# Altium schematic sheet PCB_Project_MCU.SchDoc
size A4; SheetTotal: 6; ImagePath: 6
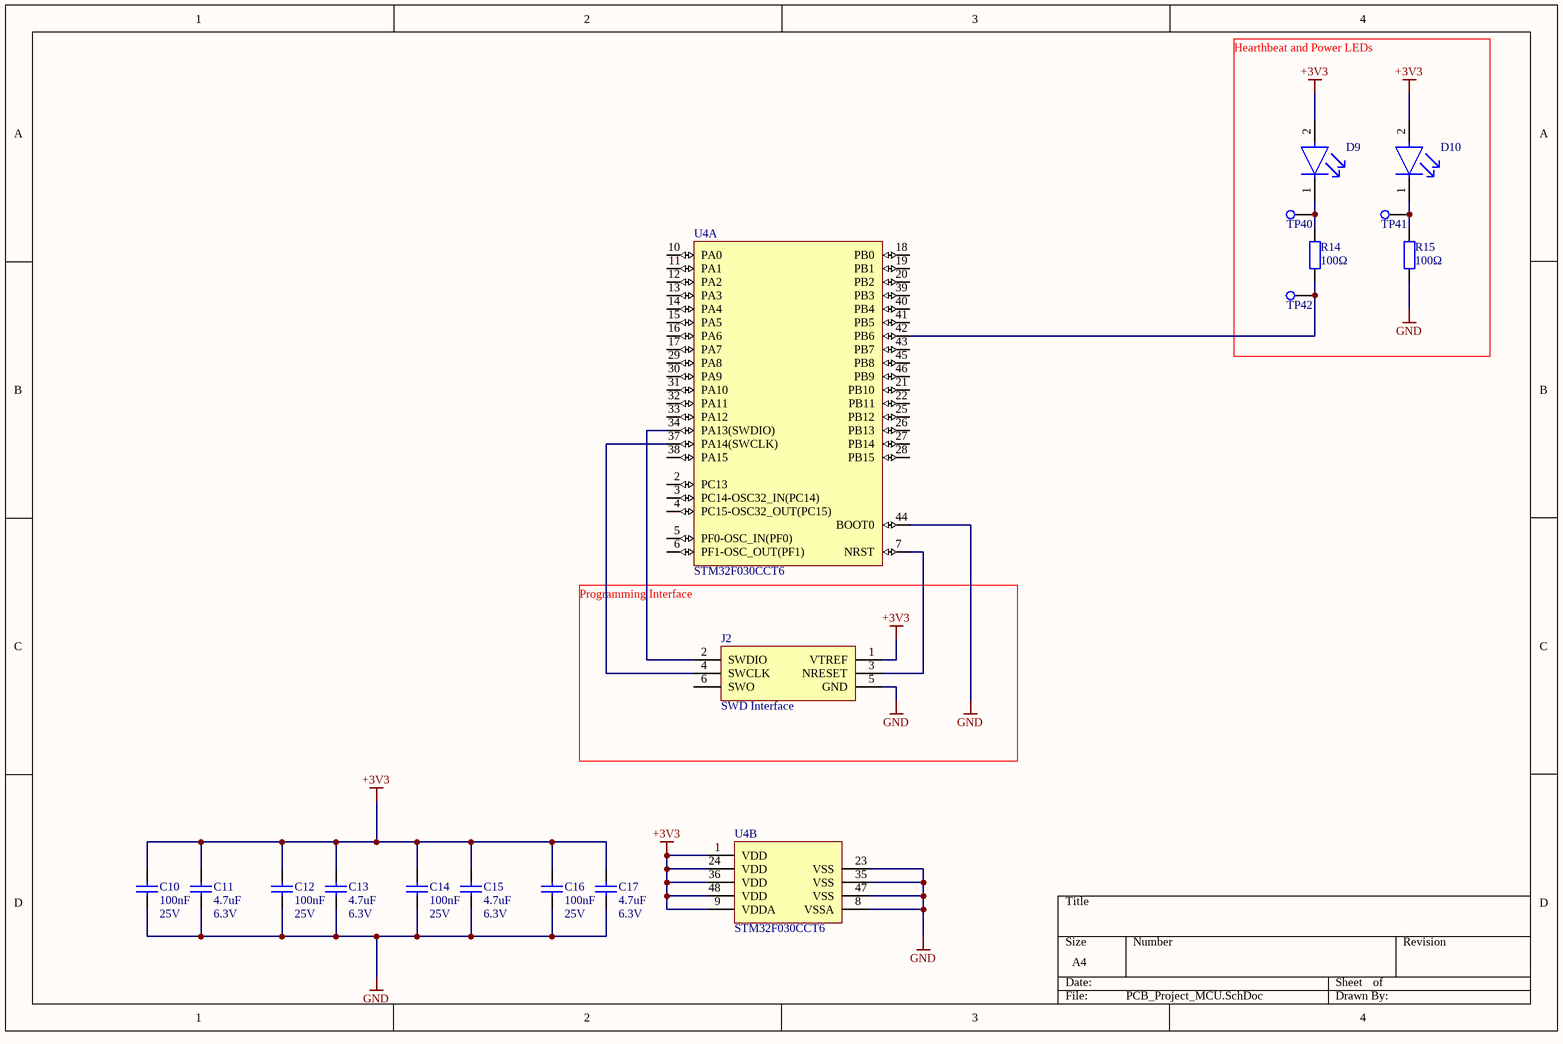
[diagram p0: PCB_Project_MCU.SchDoc]

## Parts
C10  Capacitance: 100nF  Voltage Rating: 25V  [CAPC2013X88X50ML20T25]  (hidden comment: Cap_100nF)
C11  Capacitance: 4.7uF  Voltage Rating: 6.3V  [CAPC2013X88X50ML20T25]  (hidden comment: Cap_4.7uF)
C12  Capacitance: 100nF  Voltage Rating: 25V  [CAPC2013X88X50ML20T25]  (hidden comment: Cap_100nF)
C13  Capacitance: 4.7uF  Voltage Rating: 6.3V  [CAPC2013X88X50ML20T25]  (hidden comment: Cap_4.7uF)
C14  Capacitance: 100nF  Voltage Rating: 25V  [CAPC2013X88X50ML20T25]  (hidden comment: Cap_100nF)
C15  Capacitance: 4.7uF  Voltage Rating: 6.3V  [CAPC2013X88X50ML20T25]  (hidden comment: Cap_4.7uF)
C16  Capacitance: 100nF  Voltage Rating: 25V  [CAPC2013X88X50ML20T25]  (hidden comment: Cap_100nF)
C17  Capacitance: 4.7uF  Voltage Rating: 6.3V  [CAPC2013X88X50ML20T25]  (hidden comment: Cap_4.7uF)
D9  LTST-C171GKT  [green_led]  (value not drawn)
D10  LTST-C171GKT  [green_led]  (value not drawn)
J2  SWD Interface  [J-Link_6-pin_Needle_Adapter]  (no BOM)
R14  Resistance: 100Ω  [RESC2013X50X30ML20T20]  (hidden comment: Res_120ohm)
R15  Resistance: 100Ω  [RESC2013X50X30ML20T20]  (hidden comment: Res_100ohm)
TP40  Testpoint  [TESTPOINT]  (value not drawn)  (no BOM)
TP41  Testpoint  [TESTPOINT]  (value not drawn)  (no BOM)
TP42  Testpoint  [TESTPOINT]  (value not drawn)  (no BOM)
U4  STM32F030CCT6  [STM-LQFP48_N]  (parts A,B of 2)

## Nets
+3V3: C10.2 C11.2 C12.2 C13.2 C14.2 C15.2 C16.2 C17.2 D9.2(A) D10.2(A) J2.1(VTREF) U4.1(VDD) U4.9(VDDA) U4.24(VDD) U4.36(VDD) U4.48(VDD)
GND: C10.1 C11.1 C12.1 C13.1 C14.1 C15.1 C16.1 C17.1 J2.5(GND) R15.1 U4.8(VSSA) U4.23(VSS) U4.35(VSS) U4.44(BOOT0) U4.47(VSS)
NetD9_1: D9.1(C) R14.2 TP40.TP
NetD10_1: D10.1(C) R15.2 TP41.TP
NetJ2_2: J2.2(SWDIO) U4.34(PA13(SWDIO))
NetJ2_3: J2.3(NRESET) U4.7(NRST)
NetJ2_4: J2.4(SWCLK) U4.37(PA14(SWCLK))
NetR14_1: R14.1 TP42.TP U4.42(PB6)

Not connected (* = marked no-connect by the designer): J2 6(SWO); U4 2(PC13) 3(PC14-OSC32_IN(PC14)) 4(PC15-OSC32_OUT(PC15)) 5(PF0-OSC_IN(PF0)) 6(PF1-OSC_OUT(PF1)) 10(PA0) 11(PA1) 12(PA2) 13(PA3) 14(PA4) 15(PA5) 16(PA6) 17(PA7) 18(PB0) 19(PB1) 20(PB2) 21(PB10) 22(PB11) 25(PB12) 26(PB13) 27(PB14) 28(PB15) 29(PA8) 30(PA9) 31(PA10) 32(PA11) 33(PA12) 38(PA15) 39(PB3) 40(PB4) 41(PB5) 43(PB7) 45(PB8) 46(PB9)

## Notes on the sheet
- Hearthbeat and Power LEDs
- (near J2) Programming Interface
- Gezeichnet:
- Artikelname:
- Biral AG
- CH 3110 Münsingen
- Format:
- Blatt:
- A4
- Artikelnummer:
- Zeichnungsnummer:
- Geprüft:
- Index:
- of

## Library data of the parts
C10 C12 C14 C16 = Cap_100nF: Capacitor; Manufacturer 1: KEMET; Manufacturer Part Number 1: C0805C104M3RACTU; Dielectric Material: Ceramic; Tolerance: 20%; Dielectric: X7R; Dissipation Factor: 5%; Supplier 1: Farnell; Stock 1: 12809; Pricing 1: 10=0.07910, 100=0.04240, 500=0.02510, 1000=0.02420, 2000=0.02100, 4000=0.01800, 20000=0.01260 (CHF); RoHS: Yes; Mount: Surface Mount; Case/Package: 0805; Case Code (Metric): 2012; Case Code (Imperial): 0805; Min Operating Temperature: -55°C; Max Operating Temperature: 125°C; Packaging: Tape and Reel; Package Quantity: 1; Voltage Rating (DC): 25V; Termination: SMD/SMT; Voltage: 25V; Length: 2mm; Height: 0.9mm; Width: 0.049inch; Thickness: 0.035inch; Depth: 1.25mm; Lead Pitch: 0.75mm; Radiation Hardening: No; REACH SVHC: No SVHC; ComponentLink1URL: http://uk.rs-online.com/webdocs/13da/0900766b813daa05.pdf?src-supplier=RSComponents; ComponentLink1Description: http://uk.rs-online.com/webdocs/13da/0900766b813daa05.pdf?src-supplier=RSComponents; ComponentLink2URL: http://www.mouser.com/ds/2/212/KEM_C1002_X7R_SMD-1102033.pdf?src-supplier=Mouser; ComponentLink2Description: http://www.mouser.com/ds/2/212/KEM_C1002_X7R_SMD-1102033.pdf?src-supplier=Mouser; ComponentLink3URL: http://www.farnell.com/datasheets/2746330.pdf?src-supplier=Farnell; ComponentLink3Description: http://www.farnell.com/datasheets/2746330.pdf?src-supplier=Farnell; ComponentLink4URL: https://www.alliedelec.com/m/d/6f3b5eb83d09db50ed28bdc730567b33.pdf?src-supplier=Allied+Electronics; ComponentLink4Description: https://www.alliedelec.com/m/d/6f3b5eb83d09db50ed28bdc730567b33.pdf?src-supplier=Allied+Electronics; ComponentLink5URL: http://uk.rs-online.com/webdocs/13da/0900766b813da9ff.pdf?src-supplier=RSComponents; ComponentLink5Description: http://uk.rs-online.com/webdocs/13da/0900766b813da9ff.pdf?src-supplier=RSComponents; ComponentLink6URL: https://www.alliedelec.com/m/d/e7aa2b5497e2375e4ffc0e8be19e16e2.pdf?src-supplier=Allied+Electronics; ComponentLink6Description: https://www.alliedelec.com/m/d/e7aa2b5497e2375e4ffc0e8be19e16e2.pdf?src-supplier=Allied+Electronics; ComponentLink7URL: http://components.arrow.com/part/dataview/0323_00178100?src-supplier=Arrow+Europe; ComponentLink7Description: http://components.arrow.com/part/dataview/0323_00178100?src-supplier=Arrow+Europe; ComponentLink8URL: http://www.jameco.com/Jameco/Products/ProdDS/1566487.pdf?src-supplier=Jameco; ComponentLink8Description: http://www.jameco.com/Jameco/Products/ProdDS/1566487.pdf?src-supplier=Jameco; ComponentLink9URL: https://api.kemet.com/component-edge/download/datasheet/C0805C104M3RACTU.pdf?src-supplier=Digi-Key; ComponentLink9Description: https://api.kemet.com/component-edge/download/datasheet/C0805C104M3RACTU.pdf?src-supplier=Digi-Key; ComponentLink10URL: http://www.farnell.com/datasheets/2746330.pdf?src-supplier=Newark; ComponentLink10Description: http://www.farnell.com/datasheets/2746330.pdf?src-supplier=Newark; ComponentLink11URL: http://capacitoredge.kemet.com/capedge2/DataSheet?pn=C0805C104M3RACTU&src-supplier=Avnet; ComponentLink11Description: http://capacitoredge.kemet.com/capedge2/DataSheet?pn=C0805C104M3RACTU&src-supplier=Avnet; ComponentLink12URL: http://components.arrow.com/part/dataview/2091097S3491315N7429?src-supplier=Arrow; ComponentLink12Description: http://components.arrow.com/part/dataview/2091097S3491315N7429?src-supplier=Arrow; Supplier Part Number 1: 2773209
C11 C13 C15 C17 = Cap_4.7uF: Capacitor; Manufacturer 1: KEMET; Manufacturer Part Number 1: C0805C475K9PACTU; Dielectric Material: Ceramic; Tolerance: 10%; Dielectric: X5R; Dissipation Factor: 5%; Supplier 1: Farnell; Stock 1: 17500; Pricing 1: 2500=0.02880, 12500=0.02710 (CHF); RoHS: Yes; Mount: Surface Mount; Case/Package: 0805; Number of Pins: 2; Case Code (Imperial): 0805; Case Code (Metric): 2012; Min Operating Temperature: -55°C; Max Operating Temperature: 85°C; Packaging: Tape and Reel; Voltage Rating (DC): 6.3V; Termination: SMD/SMT; Package Quantity: 1; Voltage: 6.3V; Length: 2mm; Height: 1.25mm; Width: 1.2mm; Thickness: 0.055inch; Depth: 1.25mm; Lead Pitch: 0.75mm; Radiation Hardening: No; Lead Free: Lead Free; REACH SVHC: No SVHC; ComponentLink1URL: https://datasheet.ciiva.com/7842/1847039-7842373.pdf?src-supplier=Element14; ComponentLink1Description: https://datasheet.ciiva.com/7842/1847039-7842373.pdf?src-supplier=Element14; ComponentLink2URL: https://datasheet.ciiva.com/7842/1847039-7842374.pdf?src-supplier=Element14; ComponentLink2Description: https://datasheet.ciiva.com/7842/1847039-7842374.pdf?src-supplier=Element14; ComponentLink3URL: https://datasheet.ciiva.com/28614/kem-c1006-x5r-smd-28614764.pdf?src-supplier=Element14; ComponentLink3Description: https://datasheet.ciiva.com/28614/kem-c1006-x5r-smd-28614764.pdf?src-supplier=Element14; ComponentLink4URL: https://datasheet.ciiva.com/28682/1789732-28682365.pdf?src-supplier=Element14; ComponentLink4Description: https://datasheet.ciiva.com/28682/1789732-28682365.pdf?src-supplier=Element14; Supplier Part Number 1: 2392260
D9 D10 = LTST-C171GKT: LED GREEN CLEAR CHIP SMD; Luminous Intensity: 12mcd; Lens Color: Colorless; Dominant Wavelength: 569nm; Number of LEDs: 1; Power Dissipation: 100mW; Viewing Angle: 130°; Reverse Voltage: 5V; Test Current: 10mA; Forward Voltage: 2.1V; Wavelength: 585nm; Lens Style: Diffused; Forward Current: 30mA; Height: 0.8mm; Mount: Surface Mount; Package Quantity: 1; Length: 2mm; Case Code (Metric): 2012; Number of Pins: 2; Number of Elements: 1; Packaging: Tape and Reel; Color: Green; Min Operating Temperature: -55°C; Case/Package: 0805; Power Rating: 100mW; Max Operating Temperature: 85°C; Radiation Hardening: No; Depth: 1.25mm; Lens Transparency: Clear; Width: 1.25mm; Lead Free: Lead Free; Case Code (Imperial): 0805; Illumination Color: Green
J2 = J-Link_6-pin_Needle_Adapter: J-Link 6-pin Needle Adapter
R14 = Res_120ohm: Resistor; Manufacturer 1: Panasonic; Manufacturer Part Number 1: ERJ-6ENF1200V; Tolerance: 1%; Temperature Coefficient: 100ppm/°C; Power Rating: 125mW; Voltage Rating: 150V; Supplier 1: Farnell; Stock 1: 19028; Pricing 1: 10=0.09940, 100=0.03710, 500=0.02940, 1000=0.01260, 2500=0.01050 (CHF); RoHS: Yes; Mount: Surface Mount; Case/Package: 0805; Number of Pins: 2; Case Code (Imperial): 0805; Case Code (Metric): 2012; Contact Plating: Tin; Min Operating Temperature: -55°C; Max Operating Temperature: 155°C; Packaging: Tape and Reel; Composition: Thick Film; Package Quantity: 1; Termination: SMD/SMT; Max Power Dissipation: 125mW; Voltage Rating (DC): 150V; Number of Terminations: 2; Military Standard: Not; Features: Automotive AEC-Q200; Length: 2mm; Height: 0.6mm; Width: 1.2mm; Depth: 1.25mm; Radiation Hardening: No; REACH SVHC: No SVHC; Lead Free: Lead Free; ComponentLink1URL: https://datasheet.ciiva.com/11821/0900766b80f80784-11821533.pdf?src-supplier=RSComponents; ComponentLink1Description: https://datasheet.ciiva.com/11821/0900766b80f80784-11821533.pdf?src-supplier=RSComponents; ComponentLink2URL: https://datasheet.ciiva.com/22673/1678782-22673701.pdf?src-supplier=Element14; ComponentLink2Description: https://datasheet.ciiva.com/22673/1678782-22673701.pdf?src-supplier=Element14; ComponentLink3URL: https://datasheet.ciiva.com/15158/getdatasheetpartid-248620-15158999.pdf?src-supplier=Verical; ComponentLink3Description: https://datasheet.ciiva.com/15158/getdatasheetpartid-248620-15158999.pdf?src-supplier=Verical; ComponentLink4URL: https://datasheet.ciiva.com/16782/70260748-16782215.pdf?src-supplier=Allied+Electronics; ComponentLink4Description: https://datasheet.ciiva.com/16782/70260748-16782215.pdf?src-supplier=Allied+Electronics; ComponentLink5URL: https://datasheet.ciiva.com/24069/aoa0000ce2-24069192.pdf?src-supplier=Mouser; ComponentLink5Description: https://datasheet.ciiva.com/24069/aoa0000ce2-24069192.pdf?src-supplier=Mouser; ComponentLink6URL: https://datasheet.ciiva.com/46373/1678782-46373272.pdf?src-supplier=Element14; ComponentLink6Description: https://datasheet.ciiva.com/46373/1678782-46373272.pdf?src-supplier=Element14; ComponentLink7URL: https://datasheet.ciiva.com/46373/1678782-46373273.pdf?src-supplier=Element14; ComponentLink7Description: https://datasheet.ciiva.com/46373/1678782-46373273.pdf?src-supplier=Element14; ComponentLink8URL: https://datasheet.ciiva.com/17207/aoa0000ce2-17207722.pdf?src-supplier=Avnet+Europe; ComponentLink8Description: https://datasheet.ciiva.com/17207/aoa0000ce2-17207722.pdf?src-supplier=Avnet+Europe; ComponentLink9URL: https://datasheet.ciiva.com/6082/426256-6082139.pdf?src-supplier=Farnell; ComponentLink9Description: https://datasheet.ciiva.com/6082/426256-6082139.pdf?src-supplier=Farnell; ComponentLink10URL: https://datasheet.ciiva.com/22687/1678782-22687419.pdf?src-supplier=Element14; ComponentLink10Description: https://datasheet.ciiva.com/22687/1678782-22687419.pdf?src-supplier=Element14; ComponentLink11URL: https://datasheet.ciiva.com/7886/426256-7886749.pdf?src-supplier=Element14; ComponentLink11Description: https://datasheet.ciiva.com/7886/426256-7886749.pdf?src-supplier=Element14; ComponentLink12URL: https://datasheet.ciiva.com/9117/aoa0000ce2-9117405.pdf?src-supplier=Avnet; ComponentLink12Description: https://datasheet.ciiva.com/9117/aoa0000ce2-9117405.pdf?src-supplier=Avnet; ComponentLink13URL: https://datasheet.ciiva.com/16765/70260748-16765246.pdf?src-supplier=Allied+Electronics; ComponentLink13Description: https://datasheet.ciiva.com/16765/70260748-16765246.pdf?src-supplier=Allied+Electronics; ComponentLink14URL: https://datasheet.ciiva.com/16514/aoa0000ce2-16514031.pdf?src-supplier=Avnet+Asia; ComponentLink14Description: https://datasheet.ciiva.com/16514/aoa0000ce2-16514031.pdf?src-supplier=Avnet+Asia; Supplier Part Number 1: 2303452
R15 = Res_100ohm: Resistor; Manufacturer 1: Panasonic; Manufacturer Part Number 1: ERJ-6GEYJ101V; Tolerance: 5%; Temperature Coefficient: 200ppm/°C; Power Rating: 125mW; Voltage Rating: 150V; Supplier 1: Farnell; Stock 1: 14791; Pricing 1: 10=0.08460, 100=0.03410, 500=0.02750, 1000=0.01050, 2500=0.00940 (CHF); RoHS: Yes; Mount: Surface Mount; Case/Package: 0805; Case Code (Metric): 2012; Case Code (Imperial): 0805; Contact Plating: Tin; Min Operating Temperature: -55°C; Max Operating Temperature: 155°C; Packaging: Tape and Reel; Composition: Thick Film; Package Quantity: 5000; Termination: SMD/SMT; Max Power Dissipation: 125mW; Voltage Rating (DC): 150V; Number of Terminations: 2; Military Standard: Not; Working Voltage: 150V; Length: 2mm; Height: 0.6mm; Width: 0.049inch; Depth: 1.25mm; Radiation Hardening: No; Lead Free: Lead Free; REACH SVHC: No SVHC; ComponentLink1URL: https://datasheet.ciiva.com/11821/0900766b80f806dd-11821505.pdf?src-supplier=RSComponents; ComponentLink1Description: https://datasheet.ciiva.com/11821/0900766b80f806dd-11821505.pdf?src-supplier=RSComponents; ComponentLink2URL: https://datasheet.ciiva.com/34303/2007281-34303758.pdf?src-supplier=Jameco; ComponentLink2Description: https://datasheet.ciiva.com/34303/2007281-34303758.pdf?src-supplier=Jameco; ComponentLink3URL: https://datasheet.ciiva.com/17207/aoa0000ce1-17207989.pdf?src-supplier=Avnet+Europe; ComponentLink3Description: https://datasheet.ciiva.com/17207/aoa0000ce1-17207989.pdf?src-supplier=Avnet+Europe; ComponentLink4URL: https://datasheet.ciiva.com/16760/70255313-16760982.pdf?src-supplier=Allied+Electronics; ComponentLink4Description: https://datasheet.ciiva.com/16760/70255313-16760982.pdf?src-supplier=Allied+Electronics; ComponentLink5URL: https://datasheet.ciiva.com/28514/1678796-28514232.pdf?src-supplier=Element14; ComponentLink5Description: https://datasheet.ciiva.com/28514/1678796-28514232.pdf?src-supplier=Element14; ComponentLink6URL: https://datasheet.ciiva.com/22758/1500035-22758233.pdf?src-supplier=Farnell; ComponentLink6Description: https://datasheet.ciiva.com/22758/1500035-22758233.pdf?src-supplier=Farnell; ComponentLink7URL: https://datasheet.ciiva.com/24070/aoa0000ce1-37422-24070041.pdf?src-supplier=Mouser; ComponentLink7Description: https://datasheet.ciiva.com/24070/aoa0000ce1-37422-24070041.pdf?src-supplier=Mouser; ComponentLink8URL: https://datasheet.ciiva.com/43460/1500035-43460091.pdf?src-supplier=Farnell; ComponentLink8Description: https://datasheet.ciiva.com/43460/1500035-43460091.pdf?src-supplier=Farnell; ComponentLink9URL: https://datasheet.ciiva.com/30250/4aoa0000ce1-30250447.pdf?src-supplier=Onlinecomponents.com; ComponentLink9Description: https://datasheet.ciiva.com/30250/4aoa0000ce1-30250447.pdf?src-supplier=Onlinecomponents.com; Supplier Part Number 1: 2057681
U4 = STM32F030CCT6: STMICROELECTRONICS         STM32F030CCT6             32 Bit Microcontroller, Value Line, ARM Cortex-M0, 48 MHz, 256 KB, 32 KB, 48 Pins, LQFP; Frequency: 48MHz; RAM Size: 32KB; Number of I/Os: 37; Min Supply Voltage: 2.4V; Max Supply Voltage: 3.6V; Memory Size: 256KB; Interface: I2C,SPI,USART; Data Bus Width: 32b; Number of Programmable I/O: 39; Number of Timers/Counters: 5; Supplier 1: Farnell; Manufacturer 1: STMicroelectronics; Manufacturer Part Number 1: STM32F030CCT6; Stock 1: 11542; Pricing 1: 1=3.00000, 10=2.26000, 25=2.16000, 50=2.06000, 100=1.97000, 250=1.86000, 500=1.66000, 1000=1.34000 (CHF); RoHS: Yes; Mount: Surface Mount; Case/Package: LQFP; Number of Pins: 48; Contact Plating: Tin,Matte; Min Operating Temperature: -40°C; Max Operating Temperature: 85°C; Max Frequency: 48MHz; REACH SVHC: No SVHC; Lead Free: Lead Free; ComponentLink1URL: http://www.mouser.com/ds/2/389/DM00088500-490353.pdf?src-supplier=Mouser; ComponentLink1Description: http://www.mouser.com/ds/2/389/DM00088500-490353.pdf?src-supplier=Mouser; ComponentLink2URL: http://www.farnell.com/datasheets/2554494.pdf?src-supplier=Farnell; ComponentLink2Description: http://www.farnell.com/datasheets/2554494.pdf?src-supplier=Farnell; ComponentLink3URL: http://www.st.com/st-web-ui/static/active/en/resource/technical/document/datasheet/DM00088500.pdf?src-supplier=Avnet+Asia; ComponentLink3Description: http://www.st.com/st-web-ui/static/active/en/resource/technical/document/datasheet/DM00088500.pdf?src-supplier=Avnet+Asia; ComponentLink4URL: http://www.farnell.com/datasheets/2554494.pdf?src-supplier=Newark; ComponentLink4Description: http://www.farnell.com/datasheets/2554494.pdf?src-supplier=Newark; ComponentLink5URL: http://www.st.com/content/ccc/resource/technical/document/user_manual/1d/d4/af/64/18/0d/42/2c/DM00111791.pdf/files/DM00111791.pdf/jcr:content/translations/en.DM00111791.pdf?src-supplier=Digi-Key; ComponentLink5Description: http://www.st.com/content/ccc/resource/technical/document/user_manual/1d/d4/af/64/18/0d/42/2c/DM00111791.pdf/files/DM00111791.pdf/jcr:content/translations/en.DM00111791.pdf?src-supplier=Digi-Key; ComponentLink6URL: http://www.farnell.com/datasheets/1883133.pdf?src-supplier=Element14; ComponentLink6Description: http://www.farnell.com/datasheets/1883133.pdf?src-supplier=Element14; Supplier Part Number 1: 2488281